# Altium project vending-pad-002.PrjPcb
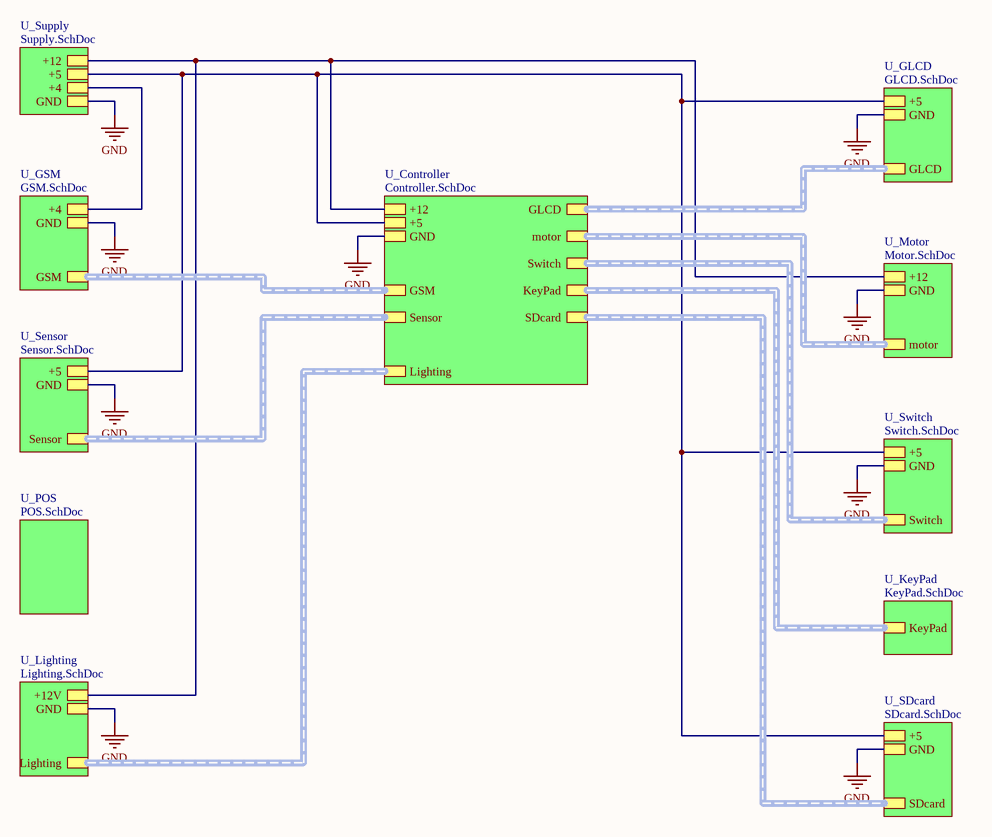
[diagram p0: main.SchDoc]
CompanyName: rshahrami; Project_Name: vend_pad; Revision: 1.0
12 sheets, 103 parts. Net scope: strictly hierarchical (ports join the sheet entries above them; power ports are local).
Board file: PCB.PcbDoc
Sheets:
  main.SchDoc
    U_GLCD = GLCD.SchDoc
    U_Controller = Controller.SchDoc
    U_GSM = GSM.SchDoc
    U_Motor = Motor.SchDoc
    U_POS = POS.SchDoc
    U_Sensor = Sensor.SchDoc
    U_Supply = Supply.SchDoc
    U_Switch = Switch.SchDoc
    U_KeyPad = KeyPad.SchDoc
    U_SDcard = SDcard.SchDoc
    U_Lighting = Lighting.SchDoc

## Sheet main.SchDoc
size A4; SheetNumber: 1; SheetTotal: 12

### Sub-sheets
U_Controller = Controller.SchDoc: GSM (harness GSM), motor (harness motor), Switch (harness Switch), GLCD (harness GLCD), +12, +5, GND, Sensor (harness Sensor), KeyPad (harness KeyPad), SDcard (harness SDcard), Lighting (harness Lighting)
U_GLCD = GLCD.SchDoc: +5, GLCD (harness GLCD), GND
U_GSM = GSM.SchDoc: +4, GND, GSM (harness GSM)
U_KeyPad = KeyPad.SchDoc: KeyPad (harness KeyPad)
U_Lighting = Lighting.SchDoc: +12V, GND, Lighting (harness Lighting)
U_Motor = Motor.SchDoc: motor (harness motor), +12, GND
U_POS = POS.SchDoc: no entries
U_SDcard = SDcard.SchDoc: +5, GND, SDcard (harness SDcard)
U_Sensor = Sensor.SchDoc: +5, GND, Sensor (harness Sensor)
U_Supply = Supply.SchDoc: GND, +4, +5, +12
U_Switch = Switch.SchDoc: +5, GND, Switch (harness Switch)

### Nets
+4: sheet U_GSM/+4, sheet U_Supply/+4
+5: sheet U_GLCD/+5, sheet U_Controller/+5, sheet U_Sensor/+5, sheet U_Supply/+5, sheet U_Switch/+5, sheet U_SDcard/+5
+12: sheet U_Controller/+12, sheet U_Motor/+12, sheet U_Supply/+12, sheet U_Lighting/+12V
GND: sheet U_GLCD/GND, sheet U_Controller/GND, sheet U_GSM/GND, sheet U_Motor/GND, sheet U_Sensor/GND, sheet U_Supply/GND, sheet U_Switch/GND, sheet U_SDcard/GND, sheet U_Lighting/GND

### Buses and harness runs
harness sheet U_Controller/GLCD = sheet U_GLCD/GLCD
harness sheet U_Controller/GSM = sheet U_GSM/GSM
harness sheet U_Controller/KeyPad = sheet U_KeyPad/KeyPad
harness sheet U_Controller/Lighting = sheet U_Lighting/Lighting
harness sheet U_Controller/motor = sheet U_Motor/motor
harness sheet U_Controller/SDcard = sheet U_SDcard/SDcard
harness sheet U_Controller/Sensor = sheet U_Sensor/Sensor
harness sheet U_Controller/Switch = sheet U_Switch/Switch

## Sheet GLCD.SchDoc
size A4; SheetNumber: 6; SheetTotal: 12
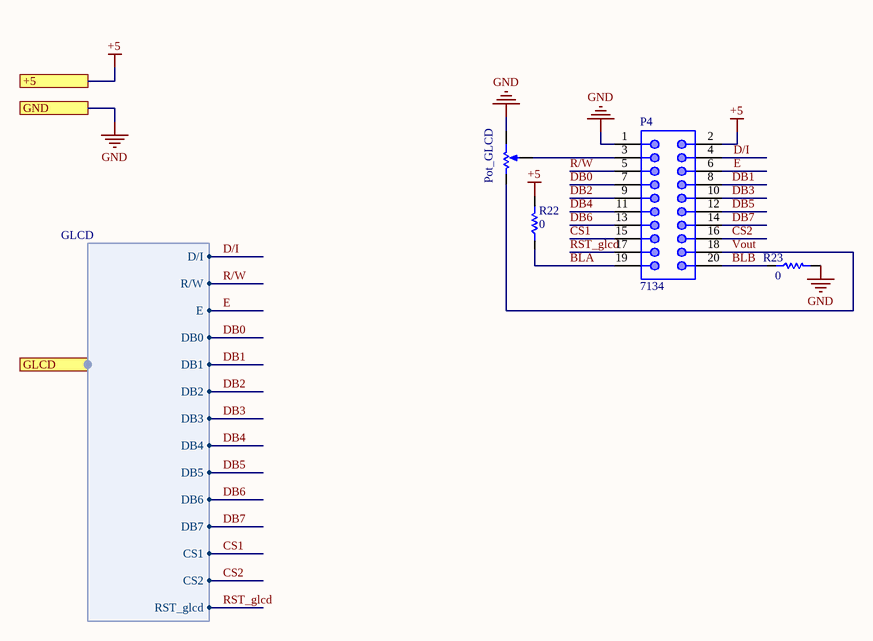
[diagram p1: GLCD.SchDoc]

### Parts
P4  Inflow: 7134  [BOX-HDR-10X2-2.54mm-S]  (hidden comment: 10x2)
Pot_GLCD  10K  [Multi turn 01]  (value not drawn)
R22  0  [RES 1206 (3216X08L)]
R23  0  [RES 1206 (3216X08L)]

### Ports
+5, GLCD (harness GLCD), GND

### Harnesses
GLCD: D/I, R/W, E, DB0, DB1, DB2, DB3, DB4, DB5, DB6, DB7, CS1, CS2, RST_glcd

### Nets
+5: P4.2 R22.2 ; port +5
GND: P4.1 Pot_GLCD.1 R23.2 ; port GND
BLA: P4.19 R22.1
BLB: P4.20 R23.1
CS1: P4.15 ; port GLCD.CS1
CS2: P4.16 ; port GLCD.CS2
D/I: P4.4 ; port GLCD.D/I
DB0: P4.7 ; port GLCD.DB0
DB1: P4.8 ; port GLCD.DB1
DB2: P4.9 ; port GLCD.DB2
DB3: P4.10 ; port GLCD.DB3
DB4: P4.11 ; port GLCD.DB4
DB5: P4.12 ; port GLCD.DB5
DB6: P4.13 ; port GLCD.DB6
DB7: P4.14 ; port GLCD.DB7
E: P4.6 ; port GLCD.E
R/W: P4.5 ; port GLCD.R/W
RST_glcd: P4.17 ; port GLCD.RST_glcd
Vout: P4.18 Pot_GLCD.3
NetP4_3: P4.3 Pot_GLCD.2

### Library data of the parts
P4 = Con_IDC_10x2: Male Box Header, 20 pins; Rating: Rating?; Validation: NT; Value: 10x2; Package: Package?; Type: Type?
Pot_GLCD = Res_Multi: Multi Turn; Rating: Rating?; Validation: Valid; Inflow: inflow?; Package: Package?; Type: Type?; Value: 10K
R22 R23 = Res_SMD_1206: Resistor; Inflow: inflow?; Rating: 0.25W; Validation: Valid; Package: 1206; Type: 10%; Value: 0

## Sheet Controller.SchDoc
size 254 x 228 mm; SheetNumber: 2; SheetTotal: 12
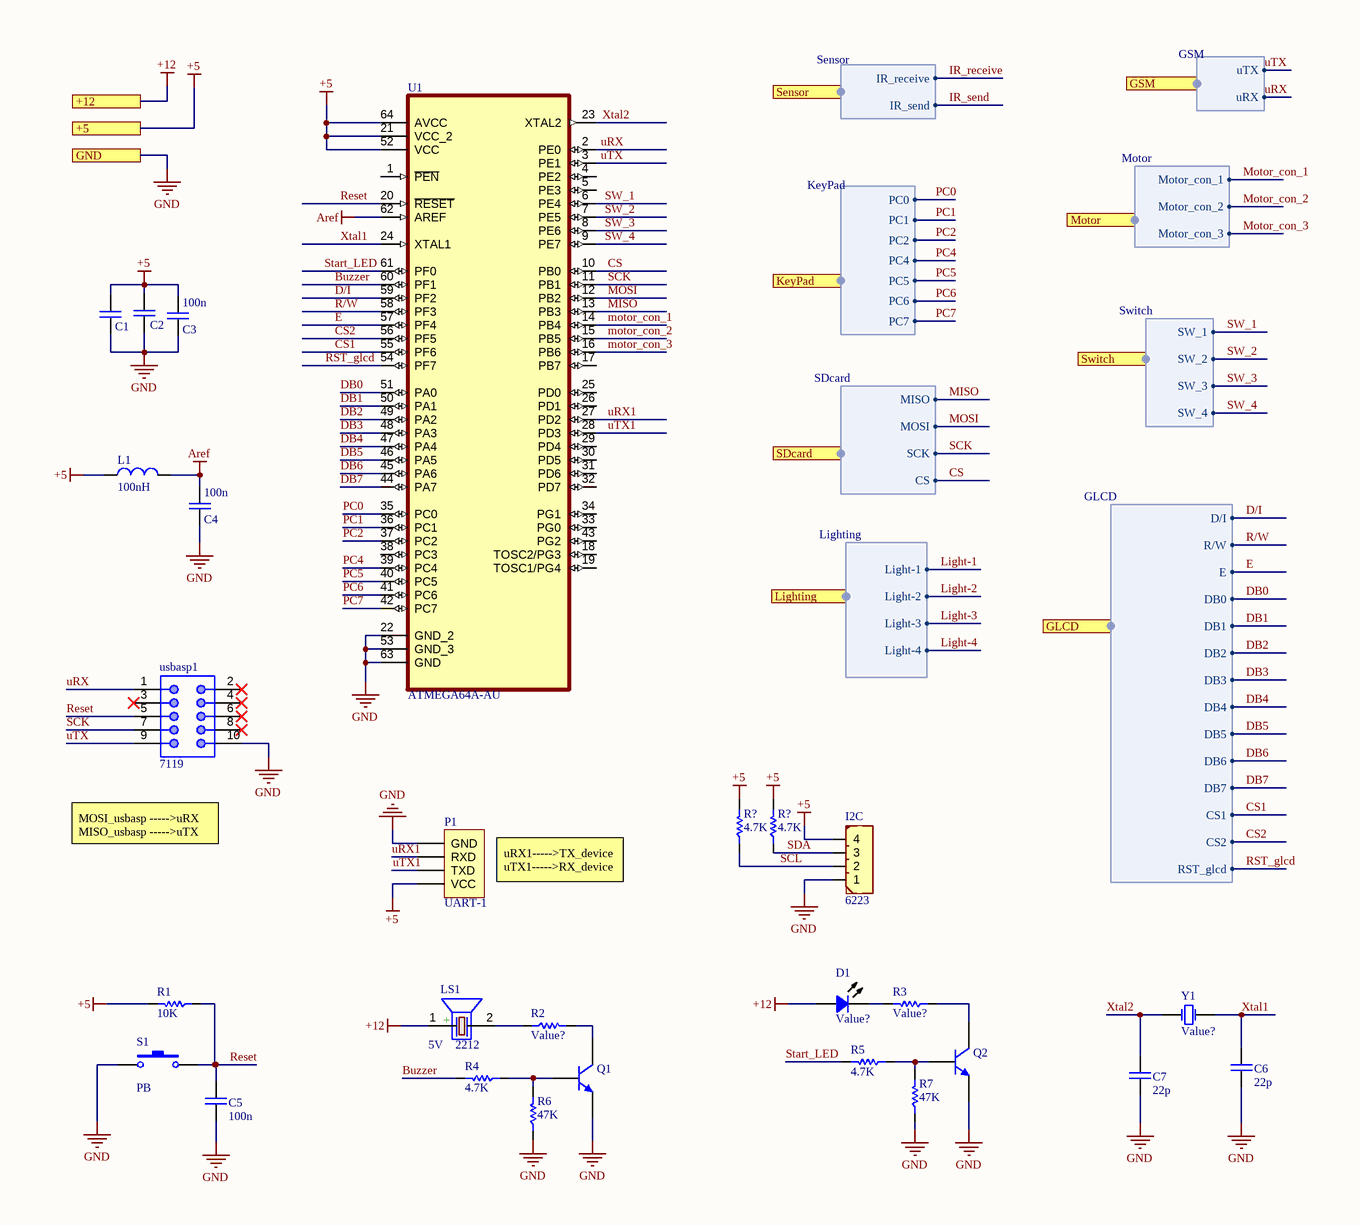
[diagram p2: Controller.SchDoc]

### Parts
(Parts that share a designator on the sheet are numbered #1, #2 ... from top to bottom, then left to right.)
C1  (no value)  [CAP 1206/3216]
C2  (no value)  [CAP 1206/3216]
C3  100n  [CAP 1206/3216]
C4  100n  [CAP 1206/3216]
C5  100n  [CAP 1206/3216]
C6  22p  [CAP 1206/3216]
C7  22p  [CAP 1206/3216]
D1  Value?  [LED 1206/3216 GREEN]
I2C  Inflow: 6223  [645004114822]  (hidden comment: 4'Pin)
L1  100nH  [IND1206]
LS1  Inflow: 2212  [BZ_SJ]  (hidden comment: 5V)
P1  UART-1  [MOLEX KK 0022272041]
Q1  NPN  [SOT23_N]  (value not drawn)
Q2  NPN  [SOT23_N]  (value not drawn)
R1  10K  [RES 1206 (3216X08L)]
R2  Value?  [RES 1206 (3216X08L)]
R3  Value?  [RES 1206 (3216X08L)]
R4  4.7K  [RES 1206 (3216X08L)]
R5  4.7K  [RES 1206 (3216X08L)]
R6  47K  [RES 1206 (3216X08L)]
R7  47K  [RES 1206 (3216X08L)]
R?#1  4.7K  [RES 0805 (2012X06L)]
R?#2  4.7K  [RES 0805 (2012X06L)]
S1  PB  [SW_PB_SMD_2PIN_SPST_6X3X2]
U1  ATMEGA64A-AU  [QFP80P1600X1600X120-64N]
usbasp1  Inflow: 7119  [BOX-HDR-5X2-2.54mm-S]  (hidden comment: 5x2)
Y1  Value?  [XTAL Small]

### Ports
+5, +12, GLCD (harness GLCD), GND, GSM (harness GSM), KeyPad (harness KeyPad), Lighting (harness Lighting), Motor (harness Motor), SDcard (harness SDcard), Sensor (harness Sensor), Switch (harness Switch)

### Harnesses
GSM: uTX, uRX
Switch: SW_1, SW_2, SW_3, SW_4
GLCD: D/I, R/W, E, DB0, DB1, DB2, DB3, DB4, DB5, DB6, DB7, CS1, CS2, RST_glcd
Sensor: IR_receive, IR_send
KeyPad: PC0, PC1, PC2, PC4, PC5, PC6, PC7
SDcard: MISO, MOSI, SCK, CS
Lighting: Light-1, Light-2, Light-3, Light-4
Motor: Motor_con_1, Motor_con_2, Motor_con_3

### Nets
+5: C1.1 C2.1 C3.1 I2C.4 L1.1 P1.1(VCC) R1.2 R?#1.2 R?#2.2 U1.21(VCC_2) U1.52(VCC) U1.64(AVCC) ; port +5
+12: D1.1 LS1.1(+) ; port +12
Aref: C4.1 L1.2 U1.62(AREF)
GND: C1.2 C2.2 C3.2 C4.2 C5.2 C6.2 C7.2 I2C.1 P1.4(GND) Q1.2(E) Q2.2(E) R6.1 R7.1 S1.1 U1.22(GND_2) U1.53(GND_3) U1.63(GND) usbasp1.10 ; port GND
Buzzer: R4.2 U1.60(PF1)
CS: U1.10(PB0) ; port SDcard.CS
CS1: U1.55(PF6) ; port GLCD.CS1
CS2: U1.56(PF5) ; port GLCD.CS2
D/I: U1.59(PF2) ; port GLCD.D/I
DB0: U1.51(PA0) ; port GLCD.DB0
DB1: U1.50(PA1) ; port GLCD.DB1
DB2: U1.49(PA2) ; port GLCD.DB2
DB3: U1.48(PA3) ; port GLCD.DB3
DB4: U1.47(PA4) ; port GLCD.DB4
DB5: U1.46(PA5) ; port GLCD.DB5
DB6: U1.45(PA6) ; port GLCD.DB6
DB7: U1.44(PA7) ; port GLCD.DB7
E: U1.57(PF4) ; port GLCD.E
MISO: U1.13(PB3) ; port SDcard.MISO
MOSI: U1.12(PB2) ; port SDcard.MOSI
Motor_con_1: U1.14(PB4) ; port Motor.Motor_con_1
Motor_con_2: U1.15(PB5) ; port Motor.Motor_con_2
Motor_con_3: U1.16(PB6) ; port Motor.Motor_con_3
PC0: U1.35(PC0) ; port KeyPad.PC0
PC1: U1.36(PC1) ; port KeyPad.PC1
PC2: U1.37(PC2) ; port KeyPad.PC2
PC4: U1.39(PC4) ; port KeyPad.PC4
PC5: U1.40(PC5) ; port KeyPad.PC5
PC6: U1.41(PC6) ; port KeyPad.PC6
PC7: U1.42(PC7) ; port KeyPad.PC7
R/W: U1.58(PF3) ; port GLCD.R/W
Reset: C5.1 R1.1 S1.2 U1.20(~{RESET}) usbasp1.5
RST_glcd: U1.54(PF7) ; port GLCD.RST_glcd
SCK: U1.11(PB1) usbasp1.7 ; port SDcard.SCK
SCL: I2C.2 R?#1.1
SDA: I2C.3 R?#2.1
Start_LED: R5.2 U1.61(PF0)
SW_1: U1.6(PE4) ; port Switch.SW_1
SW_2: U1.7(PE5) ; port Switch.SW_2
SW_3: U1.8(PE6) ; port Switch.SW_3
SW_4: U1.9(PE7) ; port Switch.SW_4
uRX: U1.2(PE0) usbasp1.1 ; port GSM.uRX
uRX1: P1.3(RXD) U1.27(PD2)
uTX: U1.3(PE1) usbasp1.9 ; port GSM.uTX
uTX1: P1.2(TXD) U1.28(PD3)
Xtal1: C6.1 U1.24(XTAL1) Y1.2(OSC2)
Xtal2: C7.1 U1.23(XTAL2) Y1.1(OSC1)
NetD1_2: D1.2 R3.2
NetLS1_2: LS1.2(-) R2.1
NetQ1_1: Q1.1(B) R4.1 R6.2
NetQ1_3: Q1.3(C) R2.2
NetQ2_1: Q2.1(B) R5.1 R7.2
NetQ2_3: Q2.3(C) R3.1

Not connected (* = marked no-connect by the designer): U1 1(~{PEN}) 4(PE2) 5(PE3) 17(PB7) 18(TOSC2/PG3) 19(TOSC1/PG4) 25(PD0) 26(PD1) 29(PD4) 30(PD5) 31(PD6) 32(PD7) 33(PG0) 34(PG1) 38(PC3) 43(PG2); usbasp1 2* 3* 4* 6* 8*

### Notes on the sheet
- MOSI_usbasp ----->uRX MISO_usbasp ----->uTX
- (near P1) uRX1----->TX_device
  uTX1----->RX_device
- DWG. NO.
- REV.
- SHT.
- THIS DOCUMENT AND THE DATA DISCLOSED HEREIN OR HEREWITH IS THE PROPERTY OF ALTIUM LIMITED AND MAY BE FREELY DISTRIBUTED IN WHOLE. NO RIGHTS ARE RESERVED OR EXPRESS OR IMPLIED WARANTEE GIVEN.
- REVISION
- DESCRIPTION
- DATE
- APPROVED
- ENG:
- APPROVALS
- PROJECT
- DSN:
- CHK:
- REFERENCE DOCUMENTS
- PROJECT REVISION:
- TITLE
- DOCUMENT REVISION:
- DESIGN ITEM:
- BOM:
- FAB DWG:
- PCB DWG:
- ASSY DWG:
- SCALE:
- SIZE
- B
- CAGE CODE
- FILE NAME
- DWG NO.
- SHEET
- OF
- REV

### Library data of the parts
C1-C7 = Cap_Multi_SMD_100nF_1206: Bipolar ceramic capacitor SMD; Type: MultiLayer; Inflow: inflow?; Rating: 50V; Validation: Valid; Package: 1206
  C3-C5: Value: 100n
  C6 C7: Value: 22p
D1 = Semi_LED_SMD: LED; Inflow: inflow?; Rating: Rating?; Validation: Valid; Package: Package?; Type: LED; Value: Value?
I2C = Con_Power_4_PC_V: 4'Pin Power Connector; Rating: Rating?; Validation: Valid; Value: 4'Pin; Package: Package?; Type: Type?
L1 = Ind_SMD_1206: Inductor; Inflow: inflow?; Type: SMD; Rating: Rating?; Validation: Valid; Package: 1206; Value: 100nH
LS1 = Other_Elec_Buzzer: Magnetic Transducer Buzzer; Rating: 12mm; Validation: Valid; Type: Buzzer; Package: Dip; Value: 5V
P1 = Con_UART: UART Connector; Rating: Rating?; Validation: Valid; Inflow: 4528; Package: Package?; Type: Type?; Value: UART-1
Q1 Q2 = Semi_BJT_BC817: NPN General purpose Transistor; Rating: Rating?; Type: Type?; Validation: Valid; Inflow: inflow?; Value: NPN; Package: Package?
R1-R7 = Res_SMD_1206: as R22 on sheet GLCD; Package: 1206; Type: 10%
  R1: Value: 10K
  R2 R3: Value: Value?
  R4 R5: Value: 4.7K
  R6 R7: Value: 47K
R?#1 R?#2 = Res_SMD_0805: Resistor; Inflow: inflow?; Rating: 0.125W; Validation: Valid; Package: 0805; Type: 10%; Value: 4.7K
S1 = SW_PushButton_2_SMD: SMT Tactile ‎Switch; Rating: 2b; Validation: Valid; Inflow: 8260; Type: Vertical; Package: SMD; Value: PB
U1 = ATMEGA64A-AU: AVR AVRÂ® ATmega Microcontroller IC 8-Bit 16MHz 64KB (32K x 16) FLASH 64-TQFP (14x14); MF: Microchip; SnapEDA_Link: https://www.snapeda.com/parts/ATMEGA64A-AU/Microchip/view-part/?ref=snap; Package: TQFP-64 Microchip; Value: *; MP: ATMEGA64A-AU; Check_prices: https://www.snapeda.com/parts/ATMEGA64A-AU/Microchip/view-part/?ref=eda
usbasp1 = Con_IDC_5x2: Male Box Header, 10 pins; Rating: Rating?; Validation: NT; Value: 5x2; Package: Package?; Type: Type?
Y1 = Other_Elec_Xtal_THT: Crystal Oscillator; Rating: Rating?; Inflow: inflow?; Validation: Valid; Type: Quartz; Package: Dip; Value: Value?

## Sheet GSM.SchDoc
size A4; SheetNumber: 4; SheetTotal: 12
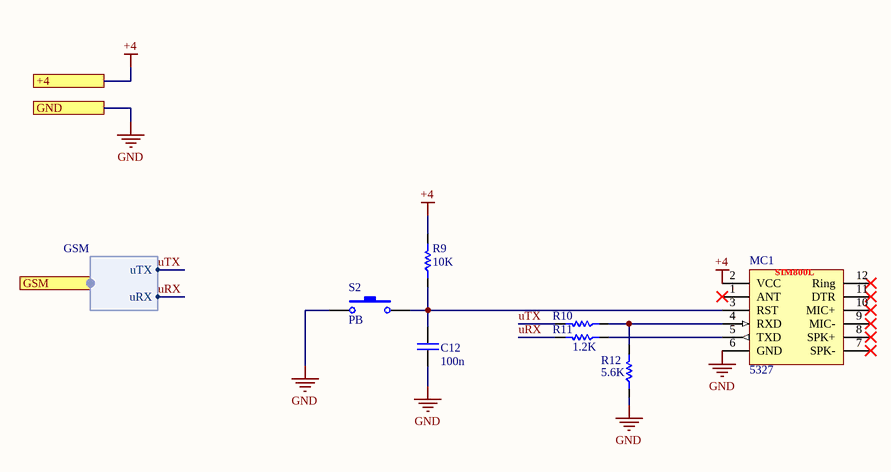
[diagram p3: GSM.SchDoc]

### Parts
C12  100n  [CAP 1206/3216]
MC1  Inflow: 5327  [Sim800L_Module]  (hidden comment: Sim800L)
R9  10K  [RES 1206 (3216X08L)]
R10  47K  [RES 1206 (3216X08L)]  (value not drawn)
R11  1.2K  [RES 1206 (3216X08L)]
R12  5.6K  [RES 1206 (3216X08L)]
S2  PB  [SW_PB_SMD_2PIN_SPST_6X3X2]

### Ports
+4, GND, GSM (harness GSM)

### Harnesses
GSM: uTX, uRX

### Nets
+4: MC1.2(VCC) R9.2 ; port +4
GND: C12.2 MC1.6(GND) R12.1 S2.2 ; port GND
uRX: R11.2 ; port GSM.uRX
uTX: R10.2 ; port GSM.uTX
NetC12_1: C12.1 MC1.3(RST) R9.1 S2.1
NetMC1_4: MC1.4(RXD) R10.1 R12.2
NetMC1_5: MC1.5(TXD) R11.1

Not connected (* = marked no-connect by the designer): MC1 1(ANT)* 7(SPK-)* 8(SPK+)* 9(MIC-)* 10(MIC+)* 11(DTR)* 12(Ring)*

### Notes on the sheet
- (in symbol ModSen_Com_Sim800L) SIM800L

### Library data of the parts
C12 = Cap_Multi_SMD_100nF_1206: as C1 on sheet Controller; Package: 1206; Value: 100n
MC1 = ModSen_Com_Sim800L: SimCom GSM/GPRS Module; Rating: Rating?; Validation: NT; Value: Sim800L; Package: Dip; Type: GSM-GPRS
R9-R12 = Res_SMD_1206: as R22 on sheet GLCD; Package: 1206; Type: 10%
  R9: Value: 10K
  R10: Value: 47K
  R11: Value: 1.2K
  R12: Value: 5.6K
S2 = SW_PushButton_2_SMD: as S1 on sheet Controller; Type: Vertical; Package: SMD; Value: PB

## Sheet Motor.SchDoc
size A4; SheetNumber: 5; SheetTotal: 12
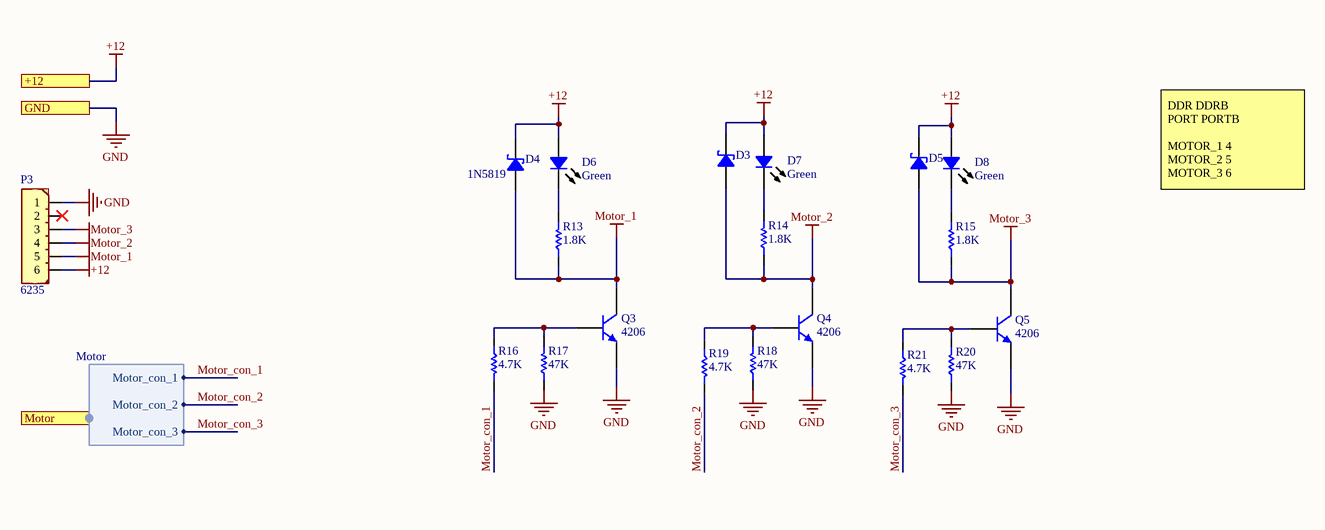
[diagram p4: Motor.SchDoc]

### Parts
D3  1N5819  [430X270D]  (value not drawn)
D4  1N5819  [430X270D]
D5  1N5819  [430X270D]  (value not drawn)
D6  Green  [LED 0805/2012 GREEN]
D7  Green  [LED 0805/2012 GREEN]
D8  Green  [LED 0805/2012 GREEN]
P3  Inflow: 6235  [645006114822]  (hidden comment: 6'Pin)
Q3  Inflow: 4206  [TO-220 AB]  (hidden comment: NPN)
Q4  Inflow: 4206  [TO-220 AB]  (hidden comment: NPN)
Q5  Inflow: 4206  [TO-220 AB]  (hidden comment: NPN)
R13  1.8K  [RES 0805 (2012X06L)]
R14  1.8K  [RES 0805 (2012X06L)]
R15  1.8K  [RES 0805 (2012X06L)]
R16  4.7K  [RES 1206 (3216X08L)]
R17  47K  [RES 1206 (3216X08L)]
R18  47K  [RES 1206 (3216X08L)]
R19  4.7K  [RES 1206 (3216X08L)]
R20  47K  [RES 1206 (3216X08L)]
R21  4.7K  [RES 1206 (3216X08L)]

### Ports
+12, GND, Motor (harness Motor)

### Harnesses
Motor: Motor_con_1, Motor_con_2, Motor_con_3

### Nets
+12: D3.2 D4.2 D5.2 D6.1 D7.1 D8.1 P3.6 ; port +12
GND: P3.1 Q3.3(E) Q4.3(E) Q5.3(E) R17.1 R18.1 R20.1 ; port GND
Motor_1: D4.1 P3.5 Q3.2(C) R13.1
Motor_2: D3.1 P3.4 Q4.2(C) R14.1
Motor_3: D5.1 P3.3 Q5.2(C) R15.1
Motor_con_1: R16.2 ; port Motor.Motor_con_1
Motor_con_2: R19.2 ; port Motor.Motor_con_2
Motor_con_3: R21.2 ; port Motor.Motor_con_3
NetD6_2: D6.2 R13.2
NetD7_2: D7.2 R14.2
NetD8_2: D8.2 R15.2
NetQ3_1: Q3.1(B) R16.1 R17.2
NetQ4_1: Q4.1(B) R18.2 R19.1
NetQ5_1: Q5.1(B) R20.2 R21.1

Not connected (* = marked no-connect by the designer): P3 2*

### Notes on the sheet
- DDR DDRB
  PORT PORTB
  MOTOR_1 4
  MOTOR_2 5
  MOTOR_3 6

### Library data of the parts
D3-D5 = Semi_Diod_Sch_1N5819_SMD: Schottky Rectifiers; Rating: Rating?; Validation: Valid; Inflow: inflow?; Package: SMA; Type: Schottky; Value: 1N5819
D6-D8 = Semi_LED_SMD: as D1 on sheet Controller; Package: Package?; Type: LED; Value: Green
P3 = Con_Power_6_PC_V: 6'Pin Power Connector; Rating: Rating?; Validation: Valid; Value: 6'Pin; Package: Package?; Type: Type?
Q3-Q5 = Semi_BJT_TIP41C: NPN Power transistor; Rating: Rating?; Type: Type?; Validation: NT; Value: NPN; Package: Package?
R13-R15 = Res_SMD_0805: as R?#1 on sheet Controller; Package: 0805; Type: 10%; Value: 1.8K
R16-R21 = Res_SMD_1206: as R22 on sheet GLCD; Package: 1206; Type: 10%
  R16 R19 R21: Value: 4.7K
  R17 R18 R20: Value: 47K

## Sheet POS.SchDoc
size A4; SheetNumber: 9; SheetTotal: 12
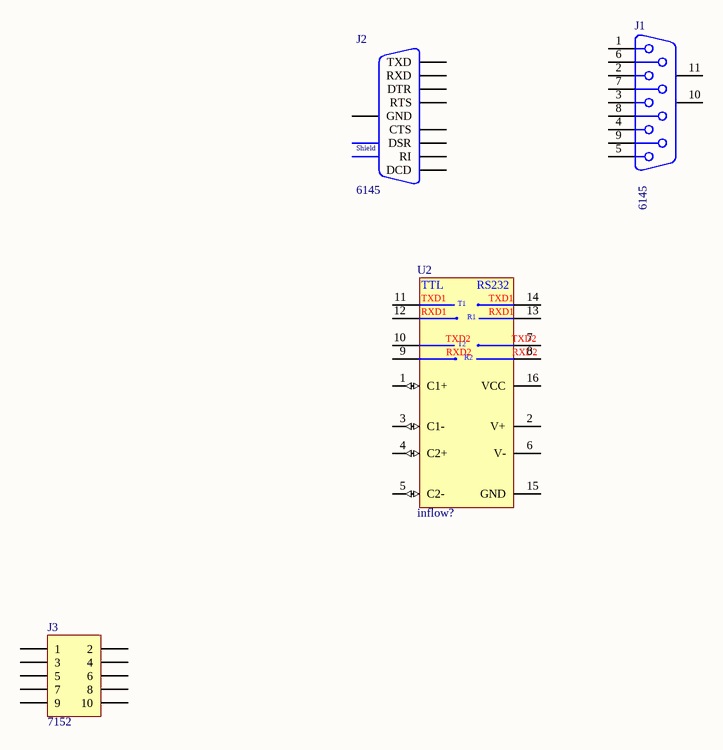
[diagram p5: POS.SchDoc]

### Parts
J1  Inflow: 6145  [DB9 Female]  (hidden comment: RS232)
J2  Inflow: 6145  [DB9 Male]  (hidden comment: RS232)
J3  Inflow: 7152  [HDR_THT_5x2M_2.54mm]  (hidden comment: 5x2)
U2  Inflow: inflow?  [NSO16_M]  (hidden comment: MAX3232)

### Nets

Not connected (* = marked no-connect by the designer): J1 1 2 3 4 5 6 7 8 9 10(MH1) 11(MH2); J2 1(DCD) 2(RXD) 3(TXD) 4(DTR) 5(GND) 6(DSR) 7(RTS) 8(CTS) 9(RI) 10(MH1) 11(MH2); J3 1 2 3 4 5 6 7 8 9 10; U2 1(C1+) 2(V+) 3(C1-) 4(C2+) 5(C2-) 6(V-) 7(T2OUT) 8(R2IN) 9(R2OUT) 10(T2IN) 11(T1IN) 12(R1OUT) 13(R1IN) 14(T1OUT) 15(GND) 16(VCC)

### Notes on the sheet
- (in symbol Con_PC_RS232) Shield
- (in symbol IC_Converter_MAX3232CSE) TTL; TXD1; T1; RXD1; R1; TXD2; T2; RXD2; R2

### Library data of the parts
J1 = Con_PC_DB9: Receptacle Assembly, 9 Position, Right Angle RS232 (COM); Rating: Rating?; Validation: Valid; Value: RS232; Package: DB9; Type: Type?
J2 = Con_PC_RS232: Receptacle Assembly, 9 Position, Right Angle RS232 (COM); Rating: Rating?; Validation: NT; Value: RS232; Package: Package?; Type: Type?
J3 = Con_MPH_5x2_V_THT_2.54: Header, dual row, 10 pin; Rating: Rating?; Validation: NT; Value: 5x2; Package: Package?; Type: Type?
U2 = IC_Converter_MAX3232CSE: RS-232 Interface IC 3.0V to 5.5V, Low-Power, up to 1Mbps, True RS-232 Transceivers Using Four 0.1uF External Capacitors; Rating: Rating?; Validation: Valid; Value: MAX3232; Package: SOIC-16; Type: RS232

## Sheet Sensor.SchDoc
size A4; SheetNumber: 7; SheetTotal: 12
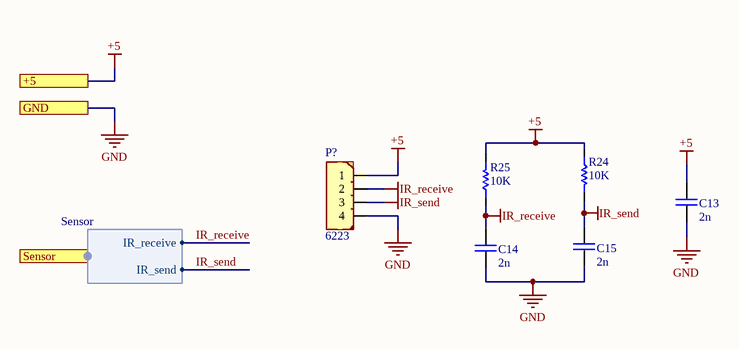
[diagram p6: Sensor.SchDoc]

### Parts
C13  2n  [CAP 1206/3216]
C14  2n  [CAP 1206/3216]
C15  2n  [CAP 1206/3216]
P?  Inflow: 6223  [645004114822]  (hidden comment: 4'Pin)
R24  10K  [RES 1206 (3216X08L)]
R25  10K  [RES 1206 (3216X08L)]

### Ports
+5, GND, Sensor (harness Sensor)

### Harnesses
Sensor: IR_receive, IR_send

### Nets
+5: C13.1 P?.1 R24.1 R25.2 ; port +5
GND: C13.2 C14.2 C15.2 P?.4 ; port GND
IR_receive: C14.1 P?.2 R25.1 ; port Sensor.IR_receive
IR_send: C15.1 P?.3 R24.2 ; port Sensor.IR_send

### Library data of the parts
C13-C15 = Cap_Multi_SMD_100nF_1206: as C1 on sheet Controller; Package: 1206; Value: 2n
P? = Con_Power_4_PC_V: as I2C on sheet Controller; Value: 4'Pin; Package: Package?; Type: Type?
R24 R25 = Res_SMD_1206: as R22 on sheet GLCD; Package: 1206; Type: 10%; Value: 10K

## Sheet Supply.SchDoc
size A4; SheetNumber: 3; SheetTotal: 12; Time: Supply
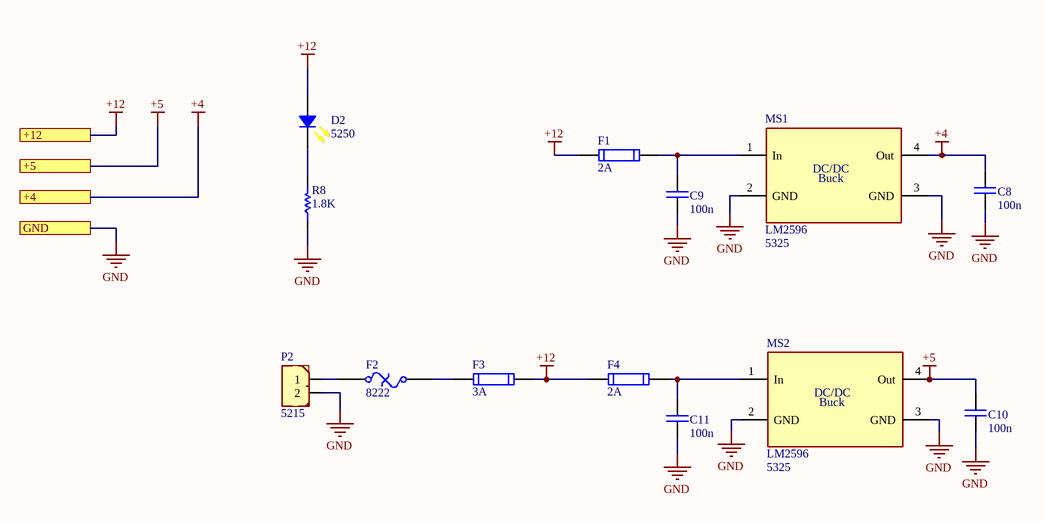
[diagram p7: Supply.SchDoc]

### Parts
C8  100n  [CAP 1206/3216]
C9  100n  [CAP 1206/3216]
C10  100n  [CAP 1206/3216]
C11  100n  [CAP 1206/3216]
D2  Inflow: 5250  [LED 1206/3216 YELLOW]  (hidden comment: Yellow, 1206)
F1  2A  [1206_F]
F2  Inflow: 8222  [PIN-W2/E2.8]  (hidden comment: 180'C, 10'A)
F3  3A  [1206_F]
F4  2A  [1206_F]
MS1  Inflow: 5325  [LM2596_modsen]  (hidden comment: LM2596)
MS2  Inflow: 5325  [LM2596_modsen]  (hidden comment: LM2596)
P2  Inflow: 5215  [645002117322]  (hidden comment: 2'Pin)
R8  1.8K  [RES 1206 (3216X08L)]

### Ports
+4, +5, +12, GND

### Nets
+4: C8.1 MS1.4(Out) ; port +4
+5: C10.1 MS2.4(Out) ; port +5
+12: D2.1 F1.1 F3.2 F4.1 ; port +12
GND: C8.2 C9.2 C10.2 C11.2 MS1.2(GND) MS1.3(GND) MS2.2(GND) MS2.3(GND) P2.2 R8.1 ; port GND
NetC9_1: C9.1 F1.2 MS1.1(In)
NetC11_1: C11.1 F4.2 MS2.1(In)
NetD2_2: D2.2 R8.2
NetF2_1: F2.1 P2.1
NetF2_2: F2.2 F3.1

### Notes on the sheet
- Title:
- Project:
- Drawn by:
- Revision:
- Hossein Bagheri
- Company:
- Sheet
- of
- (in symbol ModSen_LM2596) DC/DC; Buck

### Library data of the parts
C8-C11 = Cap_Multi_SMD_100nF_1206: as C1 on sheet Controller; Package: 1206; Value: 100n
D2 = Semi_LED_Yellow_1206: LED; Rating: Rating?; Type: Type?; Validation: Valid; Value: Yellow, 1206; Package: Package?
F1 F3 F4 = Other_Elec_Fuse_SMD: Short circiut  protection; Inflow: inflow?; Type: Fast; Rating: Rating?; Validation: Valid; Package: 1206
  F1 F4: Value: 2A
  F3: Value: 3A
F2 = Other_Elec_Fuse_Thermal: Thermal Fuse; Rating: Rating?; Type: Type?; Validation: NT; Value: 180'C, 10'A; Package: Package?
MS1 MS2 = ModSen_LM2596: DC to DC Buck converter 1.23V-30V 3A; Rating: Rating?; Validation: Valid; Package: Package?; Type: Type?; Value: LM2596
P2 = Con_Power_2_PC_H: 2'Pin Power Connector; Rating: Rating?; Validation: Valid; Value: 2'Pin; Package: Package?; Type: Type?
R8 = Res_SMD_1206: as R22 on sheet GLCD; Package: 1206; Type: 10%; Value: 1.8K

## Sheet Switch.SchDoc
size A; SheetNumber: 8; SheetTotal: 12
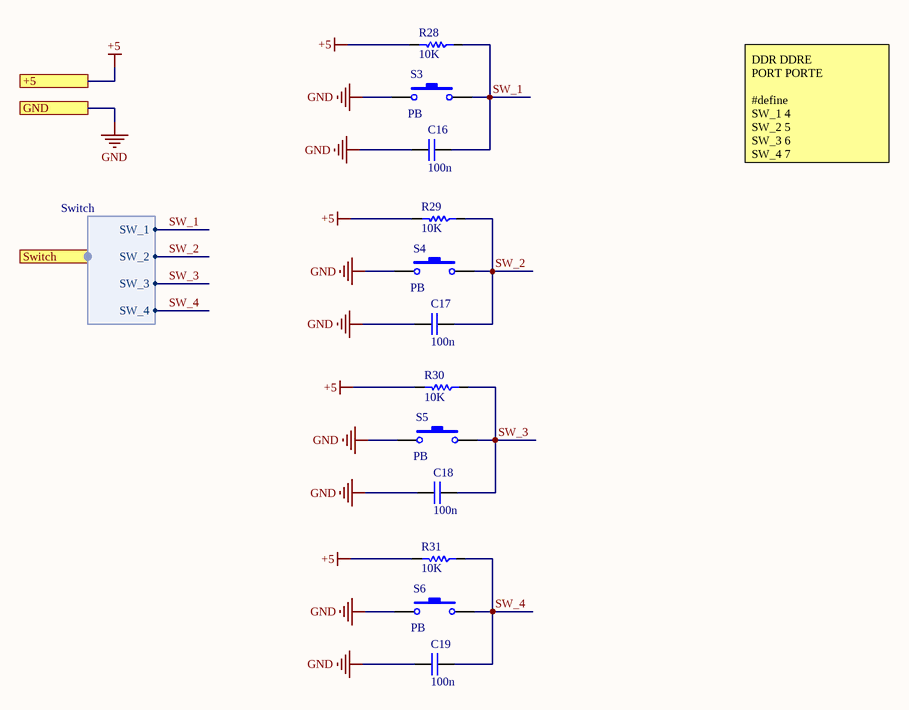
[diagram p8: Switch.SchDoc]

### Parts
C16  100n  [CAP 1206/3216]
C17  100n  [CAP 1206/3216]
C18  100n  [CAP 1206/3216]
C19  100n  [CAP 1206/3216]
R28  10K  [RES 1206 (3216X08L)]
R29  10K  [RES 1206 (3216X08L)]
R30  10K  [RES 1206 (3216X08L)]
R31  10K  [RES 1206 (3216X08L)]
S3  PB  [SW_PB_SMD_2PIN_SPST_6X3X2]
S4  PB  [SW_PB_SMD_2PIN_SPST_6X3X2]
S5  PB  [SW_PB_SMD_2PIN_SPST_6X3X2]
S6  PB  [SW_PB_SMD_2PIN_SPST_6X3X2]

### Ports
+5, GND, Switch (harness Switch)

### Harnesses
Switch: SW_1, SW_2, SW_3, SW_4

### Nets
+5: R28.2 R29.2 R30.2 R31.2 ; port +5
GND: C16.2 C17.2 C18.2 C19.2 S3.1 S4.1 S5.1 S6.1 ; port GND
SW_1: C16.1 R28.1 S3.2 ; port Switch.SW_1
SW_2: C17.1 R29.1 S4.2 ; port Switch.SW_2
SW_3: C18.1 R30.1 S5.2 ; port Switch.SW_3
SW_4: C19.1 R31.1 S6.2 ; port Switch.SW_4

### Notes on the sheet
- DDR DDRE
  PORT PORTE
  #define
  SW_1 4
  SW_2 5
  SW_3 6
  SW_4 7

### Library data of the parts
C16-C19 = Cap_Multi_SMD_100nF_1206: as C1 on sheet Controller; Package: 1206; Value: 100n
R28-R31 = Res_SMD_1206: as R22 on sheet GLCD; Package: 1206; Type: 10%; Value: 10K
S3-S6 = SW_PushButton_2_SMD: as S1 on sheet Controller; Type: Vertical; Package: SMD; Value: PB

## Sheet KeyPad.SchDoc
size A; SheetNumber: 10; SheetTotal: 12
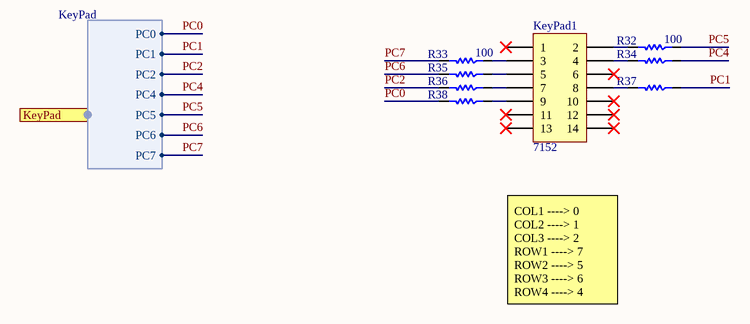
[diagram p9: KeyPad.SchDoc]

### Parts
KeyPad1  Inflow: 7152  [HDR_THT_7x2M_2.54mm]  (hidden comment: 7x2)
R32  100  [RES 1206 (3216X08L)]
R33  100  [RES 1206 (3216X08L)]
R34  10K  [RES 1206 (3216X08L)]  (value not drawn)
R35  10K  [RES 1206 (3216X08L)]  (value not drawn)
R36  10K  [RES 1206 (3216X08L)]  (value not drawn)
R37  10K  [RES 1206 (3216X08L)]  (value not drawn)
R38  10K  [RES 1206 (3216X08L)]  (value not drawn)

### Ports
KeyPad (harness KeyPad)

### Harnesses
KeyPad: PC0, PC1, PC2, PC4, PC5, PC6, PC7

### Nets
PC0: R38.2 ; port KeyPad.PC0
PC1: R37.1 ; port KeyPad.PC1
PC2: R36.2 ; port KeyPad.PC2
PC4: R34.1 ; port KeyPad.PC4
PC5: R32.1 ; port KeyPad.PC5
PC6: R35.2 ; port KeyPad.PC6
PC7: R33.2 ; port KeyPad.PC7
NetKeyPad1_2: KeyPad1.2 R32.2
NetKeyPad1_3: KeyPad1.3 R33.1
NetKeyPad1_4: KeyPad1.4 R34.2
NetKeyPad1_5: KeyPad1.5 R35.1
NetKeyPad1_7: KeyPad1.7 R36.1
NetKeyPad1_8: KeyPad1.8 R37.2
NetKeyPad1_9: KeyPad1.9 R38.1

Not connected (* = marked no-connect by the designer): KeyPad1 1* 6* 10* 11* 12* 13* 14*

### Notes on the sheet
- COL1 ----> 0
  COL2 ----> 1
  COL3 ----> 2
  ROW1 ----> 7
  ROW2 ----> 5
  ROW3 ----> 6
  ROW4 ----> 4

### Library data of the parts
KeyPad1 = Con_MPH_7x2_V_THT_2.54: Header, dual row, 14 pin; Rating: Rating?; Validation: NT; Value: 7x2; Package: Package?; Type: Type?
R32-R38 = Res_SMD_1206: as R22 on sheet GLCD; Package: 1206; Type: 10%
  R32 R33: Value: 100
  R34-R38: Value: 10K

## Sheet SDcard.SchDoc
size A; SheetNumber: 11; SheetTotal: 12
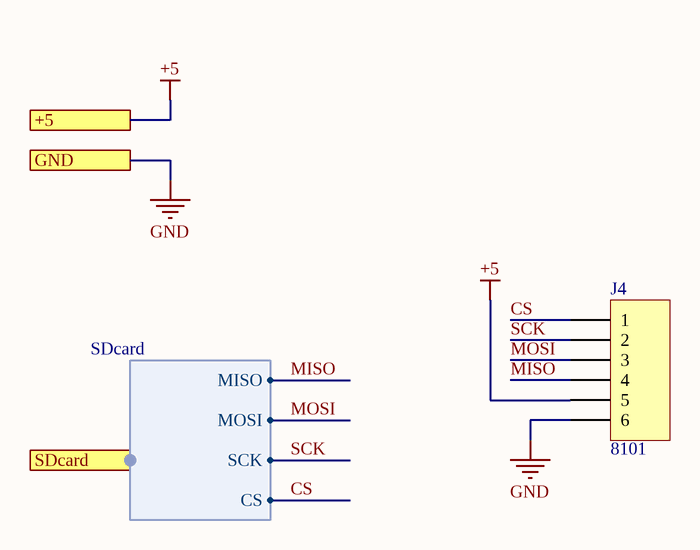
[diagram p10: SDcard.SchDoc]

### Parts
J4  Inflow: 8101  [HDR_THT_6F_2.54mm]  (hidden comment: 6)

### Ports
+5, GND, SDcard (harness SDcard)

### Harnesses
SDcard: MISO, MOSI, SCK, CS

### Nets
+5: J4.5 ; port +5
GND: J4.6 ; port GND
CS: J4.1 ; port SDcard.CS
MISO: J4.4 ; port SDcard.MISO
MOSI: J4.3 ; port SDcard.MOSI
SCK: J4.2 ; port SDcard.SCK

### Library data of the parts
J4 = Con_FPH_6x1_V_THT_2.54: Header, single row, 6 pin; Rating: Rating?; Validation: NT; Value: 6; Package: Package?; Type: Type?

## Sheet Lighting.SchDoc
size A; SheetNumber: 12; SheetTotal: 12
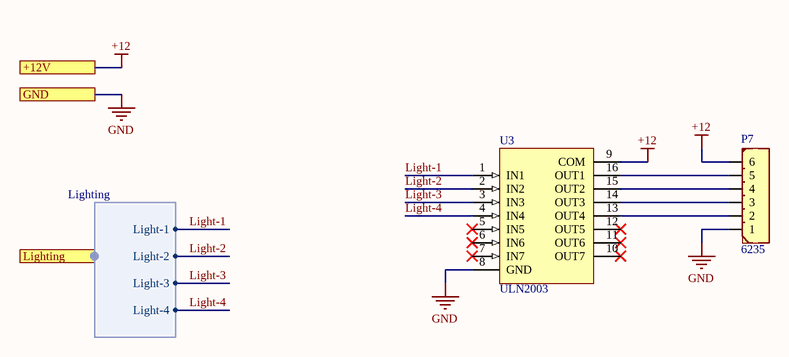
[diagram p11: Lighting.SchDoc]

### Parts
P7  Inflow: 6235  [645006114822]  (hidden comment: 6'Pin)
U3  ULN2003  [SO16_M]

### Ports
+12V, GND, Lighting (harness Lighting)

### Harnesses
Lighting: Light-1, Light-2, Light-3, Light-4

### Nets
+12: P7.6 U3.9(COM) ; port +12V
GND: P7.1 U3.8(GND) ; port GND
Light-1: U3.1(IN1) ; port Lighting.Light-1
Light-2: U3.2(IN2) ; port Lighting.Light-2
Light-3: U3.3(IN3) ; port Lighting.Light-3
Light-4: U3.4(IN4) ; port Lighting.Light-4
NetP7_2: P7.2 U3.13(OUT4)
NetP7_3: P7.3 U3.14(OUT3)
NetP7_4: P7.4 U3.15(OUT2)
NetP7_5: P7.5 U3.16(OUT1)

Not connected (* = marked no-connect by the designer): U3 5(IN5)* 6(IN6)* 7(IN7)* 10(OUT7)* 11(OUT6)* 12(OUT5)*

### Library data of the parts
P7 = Con_Power_6_PC_V: as P3 on sheet Motor; Value: 6'Pin; Package: Package?; Type: Type?
U3 = IC_Driver_ULN2003: Seven darlington array drivers; Rating: Rating?; Validation: Valid; Inflow: 1506; Package: SO-16; Type: Driver; Value: ULN2003

## Nets that join several sheets
+4: GSM (MC1.2 R9.2), Supply (C8.1 MS1.4)
+5: GLCD (P4.2 R22.2), Controller (12 pins), Sensor (C13.1 P?.1 R24.1 R25.2), Supply (C10.1 MS2.4), Switch (R28.2 R29.2 R30.2 R31.2), SDcard (J4.5)
+12: Controller (D1.1 LS1.1), Motor (7 pins), Supply (D2.1 F1.1 F3.2 F4.1), Lighting (P7.6 U3.9)
GND: GLCD (P4.1 Pot_GLCD.1 R23.2), Controller (18 pins), GSM (C12.2 MC1.6 R12.1 S2.2), Motor (7 pins), Sensor (C13.2 C14.2 C15.2 P?.4), Supply (10 pins), Switch (8 pins), SDcard (J4.6), Lighting (P7.1 U3.8)
CS: Controller (U1.10), SDcard (J4.1)
CS1: GLCD (P4.15), Controller (U1.55)
CS2: GLCD (P4.16), Controller (U1.56)
D/I: GLCD (P4.4), Controller (U1.59)
DB0: GLCD (P4.7), Controller (U1.51)
DB1: GLCD (P4.8), Controller (U1.50)
DB2: GLCD (P4.9), Controller (U1.49)
DB3: GLCD (P4.10), Controller (U1.48)
DB4: GLCD (P4.11), Controller (U1.47)
DB5: GLCD (P4.12), Controller (U1.46)
DB6: GLCD (P4.13), Controller (U1.45)
DB7: GLCD (P4.14), Controller (U1.44)
E: GLCD (P4.6), Controller (U1.57)
MISO: Controller (U1.13), SDcard (J4.4)
MOSI: Controller (U1.12), SDcard (J4.3)
Motor_con_1: Controller (U1.14), Motor (R16.2)
Motor_con_2: Controller (U1.15), Motor (R19.2)
Motor_con_3: Controller (U1.16), Motor (R21.2)
PC0: Controller (U1.35), KeyPad (R38.2)
PC1: Controller (U1.36), KeyPad (R37.1)
PC2: Controller (U1.37), KeyPad (R36.2)
PC4: Controller (U1.39), KeyPad (R34.1)
PC5: Controller (U1.40), KeyPad (R32.1)
PC6: Controller (U1.41), KeyPad (R35.2)
PC7: Controller (U1.42), KeyPad (R33.2)
R/W: GLCD (P4.5), Controller (U1.58)
RST_glcd: GLCD (P4.17), Controller (U1.54)
SCK: Controller (U1.11 usbasp1.7), SDcard (J4.2)
SW_1: Controller (U1.6), Switch (C16.1 R28.1 S3.2)
SW_2: Controller (U1.7), Switch (C17.1 R29.1 S4.2)
SW_3: Controller (U1.8), Switch (C18.1 R30.1 S5.2)
SW_4: Controller (U1.9), Switch (C19.1 R31.1 S6.2)
uRX: Controller (U1.2 usbasp1.1), GSM (R11.2)
uTX: Controller (U1.3 usbasp1.9), GSM (R10.2)